# Altium project RezzGlassesControlBoard.PrjPcb
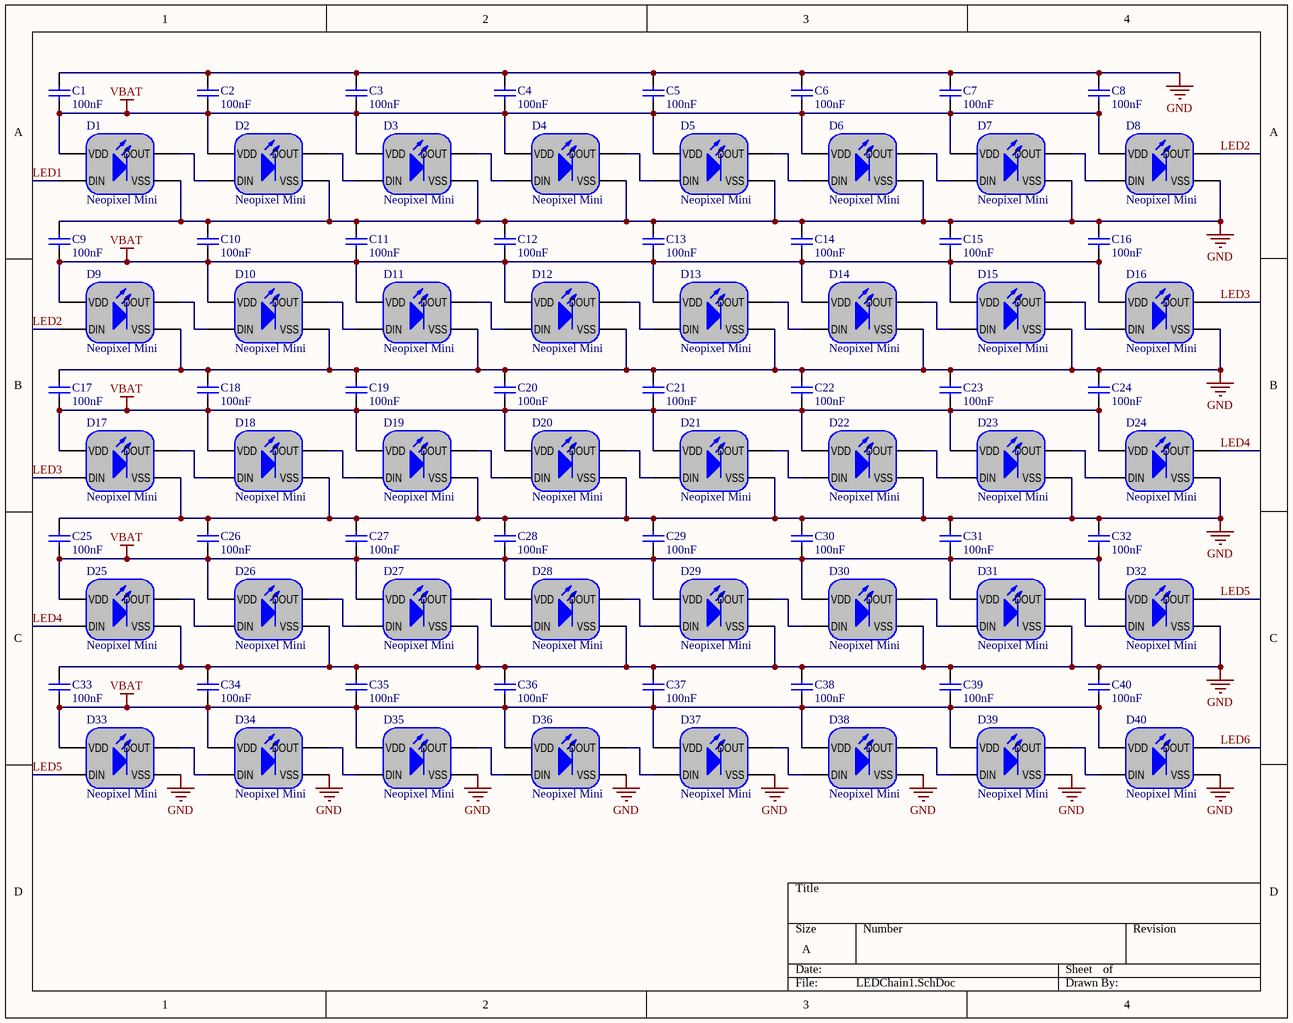
[diagram p0: LEDChain1.SchDoc]
3 sheets, 127 parts. Net scope: global (net labels, ports and power ports of the same name join across sheets).
Board file: RezzGlasses.PcbDoc
Sheets:
  LEDChain1.SchDoc
  LEDChain2.SchDoc
  Controller.SchDoc

## Sheet LEDChain1.SchDoc
size A; SheetNumber: 2; SheetTotal: 2

### Parts
C1  100nF  [0402_CAP]
C2  100nF  [0402_CAP]
C3  100nF  [0402_CAP]
C4  100nF  [0402_CAP]
C5  100nF  [0402_CAP]
C6  100nF  [0402_CAP]
C7  100nF  [0402_CAP]
C8  100nF  [0402_CAP]
C9  100nF  [0402_CAP]
C10  100nF  [0402_CAP]
C11  100nF  [0402_CAP]
C12  100nF  [0402_CAP]
C13  100nF  [0402_CAP]
C14  100nF  [0402_CAP]
C15  100nF  [0402_CAP]
C16  100nF  [0402_CAP]
C17  100nF  [0402_CAP]
C18  100nF  [0402_CAP]
C19  100nF  [0402_CAP]
C20  100nF  [0402_CAP]
C21  100nF  [0402_CAP]
C22  100nF  [0402_CAP]
C23  100nF  [0402_CAP]
C24  100nF  [0402_CAP]
C25  100nF  [0402_CAP]
C26  100nF  [0402_CAP]
C27  100nF  [0402_CAP]
C28  100nF  [0402_CAP]
C29  100nF  [0402_CAP]
C30  100nF  [0402_CAP]
C31  100nF  [0402_CAP]
C32  100nF  [0402_CAP]
C33  100nF  [0402_CAP]
C34  100nF  [0402_CAP]
C35  100nF  [0402_CAP]
C36  100nF  [0402_CAP]
C37  100nF  [0402_CAP]
C38  100nF  [0402_CAP]
C39  100nF  [0402_CAP]
C40  100nF  [0402_CAP]
D1  Neopixel Mini  [SK6812 (3535)]
D2  Neopixel Mini  [SK6812 (3535)]
D3  Neopixel Mini  [SK6812 (3535)]
D4  Neopixel Mini  [SK6812 (3535)]
D5  Neopixel Mini  [SK6812 (3535)]
D6  Neopixel Mini  [SK6812 (3535)]
D7  Neopixel Mini  [SK6812 (3535)]
D8  Neopixel Mini  [SK6812 (3535)]
D9  Neopixel Mini  [SK6812 (3535)]
D10  Neopixel Mini  [SK6812 (3535)]
D11  Neopixel Mini  [SK6812 (3535)]
D12  Neopixel Mini  [SK6812 (3535)]
D13  Neopixel Mini  [SK6812 (3535)]
D14  Neopixel Mini  [SK6812 (3535)]
D15  Neopixel Mini  [SK6812 (3535)]
D16  Neopixel Mini  [SK6812 (3535)]
D17  Neopixel Mini  [SK6812 (3535)]
D18  Neopixel Mini  [SK6812 (3535)]
D19  Neopixel Mini  [SK6812 (3535)]
D20  Neopixel Mini  [SK6812 (3535)]
D21  Neopixel Mini  [SK6812 (3535)]
D22  Neopixel Mini  [SK6812 (3535)]
D23  Neopixel Mini  [SK6812 (3535)]
D24  Neopixel Mini  [SK6812 (3535)]
D25  Neopixel Mini  [SK6812 (3535)]
D26  Neopixel Mini  [SK6812 (3535)]
D27  Neopixel Mini  [SK6812 (3535)]
D28  Neopixel Mini  [SK6812 (3535)]
D29  Neopixel Mini  [SK6812 (3535)]
D30  Neopixel Mini  [SK6812 (3535)]
D31  Neopixel Mini  [SK6812 (3535)]
D32  Neopixel Mini  [SK6812 (3535)]
D33  Neopixel Mini  [SK6812 (3535)]
D34  Neopixel Mini  [SK6812 (3535)]
D35  Neopixel Mini  [SK6812 (3535)]
D36  Neopixel Mini  [SK6812 (3535)]
D37  Neopixel Mini  [SK6812 (3535)]
D38  Neopixel Mini  [SK6812 (3535)]
D39  Neopixel Mini  [SK6812 (3535)]
D40  Neopixel Mini  [SK6812 (3535)]

### Nets
GND: C1.2 C2.2 C3.2 C4.2 C5.2 C6.2 C7.2 C8.2 C9.2 C10.2 C11.2 C12.2 C13.2 C14.2 C15.2 C16.2 C17.2 C18.2 C19.2 C20.2 C21.2 C22.2 C23.2 C24.2 C25.2 C26.2 C27.2 C28.2 C29.2 C30.2 C31.2 C32.2 C33.2 C34.2 C35.2 C36.2 C37.2 C38.2 C39.2 C40.2 D1.2(VSS) D2.2(VSS) D3.2(VSS) D4.2(VSS) D5.2(VSS) D6.2(VSS) D7.2(VSS) D8.2(VSS) D9.2(VSS) D10.2(VSS) D11.2(VSS) D12.2(VSS) D13.2(VSS) D14.2(VSS) D15.2(VSS) D16.2(VSS) D17.2(VSS) D18.2(VSS) D19.2(VSS) D20.2(VSS) D21.2(VSS) D22.2(VSS) D23.2(VSS) D24.2(VSS) D25.2(VSS) D26.2(VSS) D27.2(VSS) D28.2(VSS) D29.2(VSS) D30.2(VSS) D31.2(VSS) D32.2(VSS) D33.2(VSS) D34.2(VSS) D35.2(VSS) D36.2(VSS) D37.2(VSS) D38.2(VSS) D39.2(VSS) D40.2(VSS)
VBAT: C1.1 C2.1 C3.1 C4.1 C5.1 C6.1 C7.1 C8.1 C9.1 C10.1 C11.1 C12.1 C13.1 C14.1 C15.1 C16.1 C17.1 C18.1 C19.1 C20.1 C21.1 C22.1 C23.1 C24.1 C25.1 C26.1 C27.1 C28.1 C29.1 C30.1 C31.1 C32.1 C33.1 C34.1 C35.1 C36.1 C37.1 C38.1 C39.1 C40.1 D1.4(VDD) D2.4(VDD) D3.4(VDD) D4.4(VDD) D5.4(VDD) D6.4(VDD) D7.4(VDD) D8.4(VDD) D9.4(VDD) D10.4(VDD) D11.4(VDD) D12.4(VDD) D13.4(VDD) D14.4(VDD) D15.4(VDD) D16.4(VDD) D17.4(VDD) D18.4(VDD) D19.4(VDD) D20.4(VDD) D21.4(VDD) D22.4(VDD) D23.4(VDD) D24.4(VDD) D25.4(VDD) D26.4(VDD) D27.4(VDD) D28.4(VDD) D29.4(VDD) D30.4(VDD) D31.4(VDD) D32.4(VDD) D33.4(VDD) D34.4(VDD) D35.4(VDD) D36.4(VDD) D37.4(VDD) D38.4(VDD) D39.4(VDD) D40.4(VDD)
LED1: D1.3(DIN)
LED2: D8.1(DOUT) D9.3(DIN)
LED3: D16.1(DOUT) D17.3(DIN)
LED4: D24.1(DOUT) D25.3(DIN)
LED5: D32.1(DOUT) D33.3(DIN)
LED6: D40.1(DOUT)
NetD1_1: D1.1(DOUT) D2.3(DIN)
NetD2_1: D2.1(DOUT) D3.3(DIN)
NetD3_1: D3.1(DOUT) D4.3(DIN)
NetD4_1: D4.1(DOUT) D5.3(DIN)
NetD5_1: D5.1(DOUT) D6.3(DIN)
NetD6_1: D6.1(DOUT) D7.3(DIN)
NetD7_1: D7.1(DOUT) D8.3(DIN)
NetD9_1: D9.1(DOUT) D10.3(DIN)
NetD10_1: D10.1(DOUT) D11.3(DIN)
NetD11_1: D11.1(DOUT) D12.3(DIN)
NetD12_1: D12.1(DOUT) D13.3(DIN)
NetD13_1: D13.1(DOUT) D14.3(DIN)
NetD14_1: D14.1(DOUT) D15.3(DIN)
NetD15_1: D15.1(DOUT) D16.3(DIN)
NetD17_1: D17.1(DOUT) D18.3(DIN)
NetD18_1: D18.1(DOUT) D19.3(DIN)
NetD19_1: D19.1(DOUT) D20.3(DIN)
NetD20_1: D20.1(DOUT) D21.3(DIN)
NetD21_1: D21.1(DOUT) D22.3(DIN)
NetD22_1: D22.1(DOUT) D23.3(DIN)
NetD23_1: D23.1(DOUT) D24.3(DIN)
NetD25_1: D25.1(DOUT) D26.3(DIN)
NetD26_1: D26.1(DOUT) D27.3(DIN)
NetD27_1: D27.1(DOUT) D28.3(DIN)
NetD28_1: D28.1(DOUT) D29.3(DIN)
NetD29_1: D29.1(DOUT) D30.3(DIN)
NetD30_1: D30.1(DOUT) D31.3(DIN)
NetD31_1: D31.1(DOUT) D32.3(DIN)
NetD33_1: D33.1(DOUT) D34.3(DIN)
NetD34_1: D34.1(DOUT) D35.3(DIN)
NetD35_1: D35.1(DOUT) D36.3(DIN)
NetD36_1: D36.1(DOUT) D37.3(DIN)
NetD37_1: D37.1(DOUT) D38.3(DIN)
NetD38_1: D38.1(DOUT) D39.3(DIN)
NetD39_1: D39.1(DOUT) D40.3(DIN)

### Library data of the parts
C1-C40 = CAP_100N_0603: CAP CER 0.1UF 16V X7R 0402; Published: 8-Jun-2000; LatestRevisionDate: 17-Jul-2002; LatestRevisionNote: Re-released for DXP Platform.; Publisher: Altium Limited; PackageDescription: Radial Cap, Thru-Hole; 2 Leads; 0.3 in Pin Spacing; PackageReference: RAD-0.3; Supplier 1: Digi-Key; Supplier Part Number 1: 587-1451-1-ND
D1-D40 = SK6812MINI-B-001: ADDRESS LED DISC SERIAL RGB; Supplier 1: Digi-Key; Supplier Part Number 1: 1528-1541-ND

## Sheet LEDChain2.SchDoc
size A; SheetNumber: 3; SheetTotal: 3
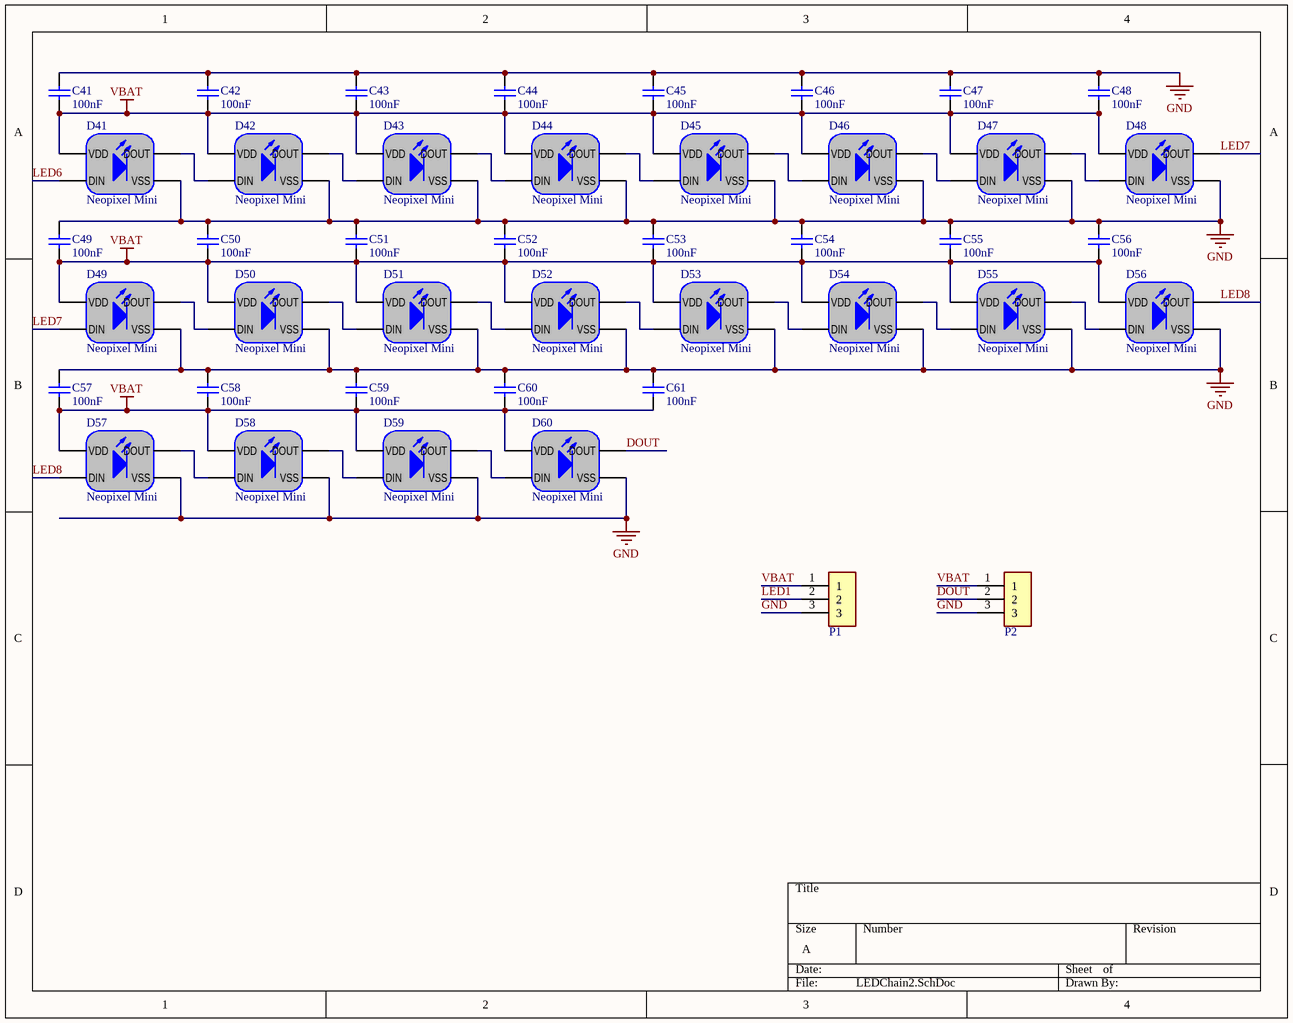
[diagram p1: LEDChain2.SchDoc]

### Parts
C41  100nF  [0402_CAP]
C42  100nF  [0402_CAP]
C43  100nF  [0402_CAP]
C44  100nF  [0402_CAP]
C45  100nF  [0402_CAP]
C46  100nF  [0402_CAP]
C47  100nF  [0402_CAP]
C48  100nF  [0402_CAP]
C49  100nF  [0402_CAP]
C50  100nF  [0402_CAP]
C51  100nF  [0402_CAP]
C52  100nF  [0402_CAP]
C53  100nF  [0402_CAP]
C54  100nF  [0402_CAP]
C55  100nF  [0402_CAP]
C56  100nF  [0402_CAP]
C57  100nF  [0402_CAP]
C58  100nF  [0402_CAP]
C59  100nF  [0402_CAP]
C60  100nF  [0402_CAP]
C61  100nF  [0402_CAP]
D41  Neopixel Mini  [SK6812 (3535)]
D42  Neopixel Mini  [SK6812 (3535)]
D43  Neopixel Mini  [SK6812 (3535)]
D44  Neopixel Mini  [SK6812 (3535)]
D45  Neopixel Mini  [SK6812 (3535)]
D46  Neopixel Mini  [SK6812 (3535)]
D47  Neopixel Mini  [SK6812 (3535)]
D48  Neopixel Mini  [SK6812 (3535)]
D49  Neopixel Mini  [SK6812 (3535)]
D50  Neopixel Mini  [SK6812 (3535)]
D51  Neopixel Mini  [SK6812 (3535)]
D52  Neopixel Mini  [SK6812 (3535)]
D53  Neopixel Mini  [SK6812 (3535)]
D54  Neopixel Mini  [SK6812 (3535)]
D55  Neopixel Mini  [SK6812 (3535)]
D56  Neopixel Mini  [SK6812 (3535)]
D57  Neopixel Mini  [SK6812 (3535)]
D58  Neopixel Mini  [SK6812 (3535)]
D59  Neopixel Mini  [SK6812 (3535)]
D60  Neopixel Mini  [SK6812 (3535)]
P1  HEADER_1x3_TIGHT  [PIN3 - TIGHT]  (value not drawn)
P2  HEADER_1x3_TIGHT  [PIN3 - TIGHT]  (value not drawn)

### Nets
GND: C41.2 C42.2 C43.2 C44.2 C45.2 C46.2 C47.2 C48.2 C49.2 C50.2 C51.2 C52.2 C53.2 C54.2 C55.2 C56.2 C57.2 C58.2 C59.2 C60.2 C61.2 D41.2(VSS) D42.2(VSS) D43.2(VSS) D44.2(VSS) D45.2(VSS) D46.2(VSS) D47.2(VSS) D48.2(VSS) D49.2(VSS) D50.2(VSS) D51.2(VSS) D52.2(VSS) D53.2(VSS) D54.2(VSS) D55.2(VSS) D56.2(VSS) D57.2(VSS) D58.2(VSS) D59.2(VSS) D60.2(VSS) P1.3 P2.3
VBAT: C41.1 C42.1 C43.1 C44.1 C45.1 C46.1 C47.1 C48.1 C49.1 C50.1 C51.1 C52.1 C53.1 C54.1 C55.1 C56.1 C57.1 C58.1 C59.1 C60.1 C61.1 D41.4(VDD) D42.4(VDD) D43.4(VDD) D44.4(VDD) D45.4(VDD) D46.4(VDD) D47.4(VDD) D48.4(VDD) D49.4(VDD) D50.4(VDD) D51.4(VDD) D52.4(VDD) D53.4(VDD) D54.4(VDD) D55.4(VDD) D56.4(VDD) D57.4(VDD) D58.4(VDD) D59.4(VDD) D60.4(VDD) P1.1 P2.1
DOUT: D60.1(DOUT) P2.2
LED1: P1.2
LED6: D41.3(DIN)
LED7: D48.1(DOUT) D49.3(DIN)
LED8: D56.1(DOUT) D57.3(DIN)
NetD41_1: D41.1(DOUT) D42.3(DIN)
NetD42_1: D42.1(DOUT) D43.3(DIN)
NetD43_1: D43.1(DOUT) D44.3(DIN)
NetD44_1: D44.1(DOUT) D45.3(DIN)
NetD45_1: D45.1(DOUT) D46.3(DIN)
NetD46_1: D46.1(DOUT) D47.3(DIN)
NetD47_1: D47.1(DOUT) D48.3(DIN)
NetD49_1: D49.1(DOUT) D50.3(DIN)
NetD50_1: D50.1(DOUT) D51.3(DIN)
NetD51_1: D51.1(DOUT) D52.3(DIN)
NetD52_1: D52.1(DOUT) D53.3(DIN)
NetD53_1: D53.1(DOUT) D54.3(DIN)
NetD54_1: D54.1(DOUT) D55.3(DIN)
NetD55_1: D55.1(DOUT) D56.3(DIN)
NetD57_1: D57.1(DOUT) D58.3(DIN)
NetD58_1: D58.1(DOUT) D59.3(DIN)
NetD59_1: D59.1(DOUT) D60.3(DIN)

### Library data of the parts
C41-C61 = CAP_100N_0603: CAP CER 0.1UF 16V X7R 0402; Published: 8-Jun-2000; LatestRevisionDate: 17-Jul-2002; LatestRevisionNote: Re-released for DXP Platform.; Publisher: Altium Limited; PackageDescription: Radial Cap, Thru-Hole; 2 Leads; 0.3 in Pin Spacing; PackageReference: RAD-0.3; Supplier 1: Digi-Key; Supplier Part Number 1: 587-1451-1-ND
D41-D60 = SK6812MINI-B-001: ADDRESS LED DISC SERIAL RGB; Supplier 1: Digi-Key; Supplier Part Number 1: 1528-1541-ND

## Sheet Controller.SchDoc
size A; SheetNumber: 1; SheetTotal: 4
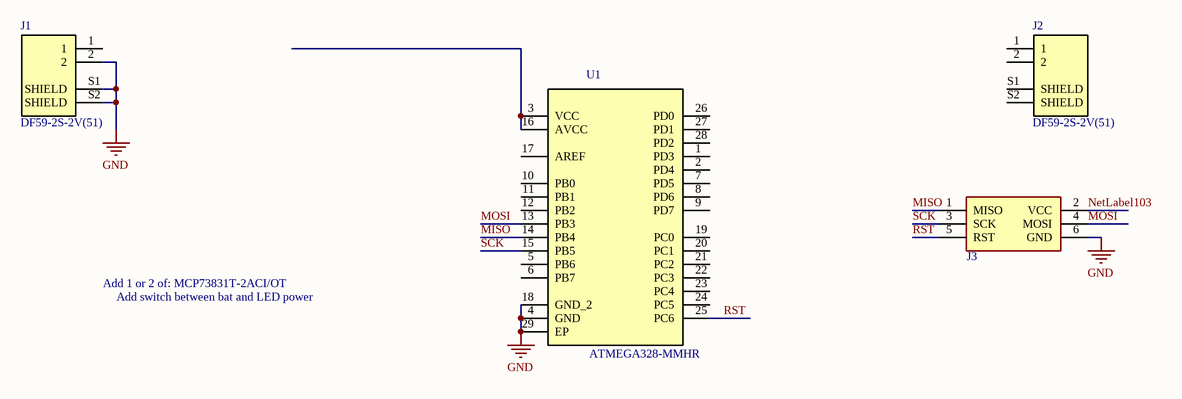
[diagram p2: Controller.SchDoc]

### Parts
J1  DF59-2S-2V(51)  [SNAPBEE_DF59-2S-2V]
J2  DF59-2S-2V(51)  [SNAPBEE_DF59-2S-2V]
J3  6 Pin ISP Header  [CONN_ISP_M]  (value not drawn)
U1  ATMEGA328-MMHR  [QFN-28_4x4]

### Nets
GND: J1.2 J1.S1(SHIELD) J1.S2(SHIELD) J3.6(GND) U1.4(GND) U1.18(GND_2) U1.29(EP)
MISO: J3.1(MISO) U1.14(PB4)
MOSI: J3.4(MOSI) U1.13(PB3)
NetLabel103: J3.2(VCC)
RST: J3.5(RST) U1.25(PC6)
SCK: J3.3(SCK) U1.15(PB5)
NetU1_3: U1.3(VCC) U1.16(AVCC)

Not connected (* = marked no-connect by the designer): J1 1; J2 1 2 S1(SHIELD) S2(SHIELD); U1 1(PD3) 2(PD4) 5(PB6) 6(PB7) 7(PD5) 8(PD6) 9(PD7) 10(PB0) 11(PB1) 12(PB2) 17(AREF) 19(PC0) 20(PC1) 21(PC2) 22(PC3) 23(PC4) 24(PC5) 26(PD0) 27(PD1) 28(PD2)

### Notes on the sheet
- Add 1 or 2 of: MCP73831T-2ACI/OT
- Add switch between bat and LED power

### Library data of the parts
J1 J2 = SNAPBEE_DF59-2S-2V: CONN SSL RCPT 2POS 2MM SOLDER; Supplier 1: Digi-Key; Supplier 2: Digi-Key; Supplier 3: Digi-Key; Supplier Part Number 1: H11961CT-ND; Supplier Part Number 2: H11958-ND; Supplier Part Number 3: H11957CT-ND
J3 = ISP
U1 = ATMEGA328-MMHR: IC MCU 8BIT 32KB FLASH 28VQFN; MF: Microchip; MP: ATMEGA328P-PU; SnapEDA_Link: https://www.snapeda.com/parts/ATMEGA328P-PU/Microchip/view-part/?ref=snap; Package: PDIP-28 Microchip; Price: None; Availability: Unavailable; Value: *; Supplier 1: Digi-Key; Supplier Part Number 1: ATMEGA328-MMHRCT-ND

## Nets that join several sheets
GND: LEDChain1 (80 pins), LEDChain2 (43 pins), Controller (7 pins)
VBAT: LEDChain1 (80 pins), LEDChain2 (43 pins)
LED1: LEDChain1 (D1.3), LEDChain2 (P1.2)
LED6: LEDChain1 (D40.1), LEDChain2 (D41.3)